# Altium schematic sheet TrailerWiringSchem.SchDoc
size A; SheetNumber: 1; SheetTotal: 1
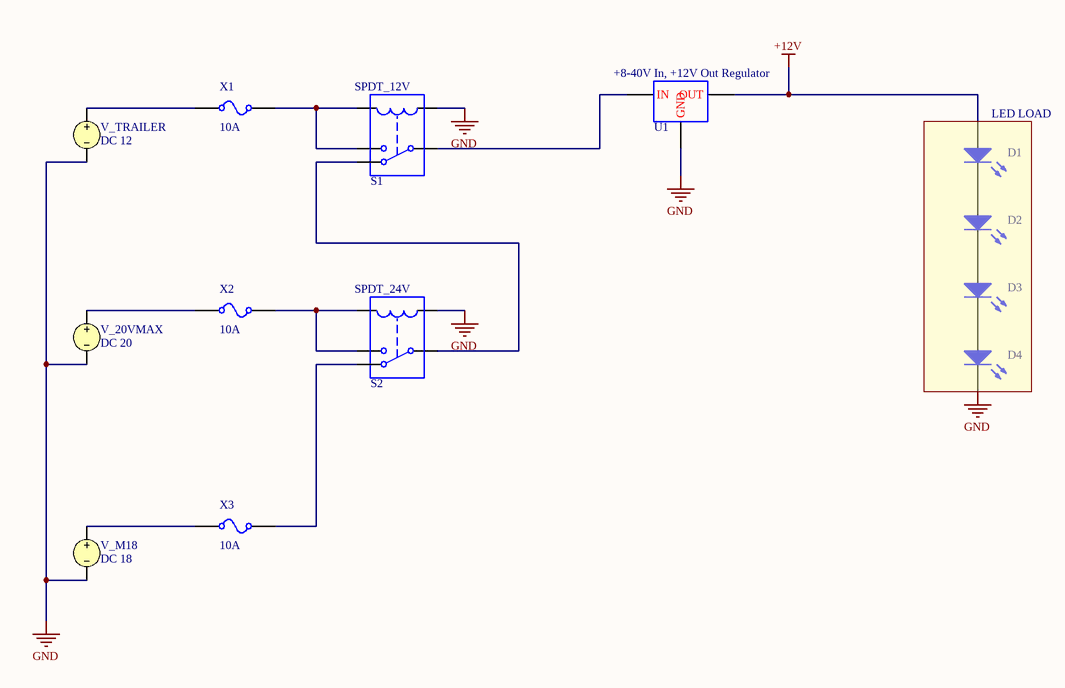
[diagram p0: TrailerWiringSchem.SchDoc]

## Parts
D1  Light-Emitting Diode  (value not drawn)
D2  Light-Emitting Diode  (value not drawn)
D3  Light-Emitting Diode  (value not drawn)
D4  Light-Emitting Diode  (value not drawn)
S1  SPDT_12V
S2  SPDT_24V
U1  +8-40V In, +12V Out Regulator
V_20VMAX  DC 20
V_M18  DC 18
V_TRAILER  DC 12
X1  CURRENT: 10A  (hidden comment: Fuse)
X2  CURRENT: 10A  (hidden comment: Fuse)
X3  CURRENT: 10A  (hidden comment: Fuse)

## Blocks framed on the sheet
LED LOAD: D1-D4

## Nets
+12V: D1.1(A) U1.3(OUT)
GND: D4.2(K) S1.4 S2.4 U1.2(GND) V_20VMAX.2 V_M18.2 V_TRAILER.2
NetD1_2: D1.2(K) D2.1(A)
NetD2_2: D2.2(K) D3.1(A)
NetD3_2: D3.2(K) D4.1(A)
NetS1_1: S1.1 U1.1(IN)
NetS1_2: S1.2 S1.5 X1.2
NetS1_3: S1.3 S2.1
NetS2_2: S2.2 S2.5 X2.2
NetS2_3: S2.3 X3.2
NetV_20VMAX_1: V_20VMAX.1 X2.1
NetV_M18_1: V_M18.1 X3.1
NetV_TRAILER_1: V_TRAILER.1 X1.1

## Library data of the parts
D1-D4 = LED: AF: 1; BV: 0; BV_MAX: 1e99; EG: 1.11; FC: 0.5; IBV: 0.001; IS: 1e-14; MJSW: 0.33; NTUN: 30; TNOM: 27; XTI: 3; SimulationGenericComponent: True; CJO: 0; CJP: 0; CTA: 0; CTP: 0; FCS: 0.5; FV_MAX: 1e99; IKF: 0; IKR: 0; ISR: 1e-14; JSW: 0; JTUN: 0; JTUNSW: 0; KEG: 1; KF: 0; LEVEL: 1; N: 1; NBV: 1; NR: 1; NS: 1; PHP: 1; RS: 0; TCV: 0; TLEV: 0; TLEVC: 0; TM1: 0; TM2: 0; TPB: 0; TPHP: 0; TRS: 0; TRS2: 0; TT: 0; TTT1: 0; TTT2: 0; VJ: 1; XTITUN: 3
S1 S2 = SPDT Relay: Single-Pole, Double-Throw Relay; L_C: 1u; R_C: 100; RON: 1; ROFF: 1e12; ION: 1m; IOFF: 0; SimulationGenericComponent: True
U1 = Linear Voltage Regulator (Fixed): Positive Fixed Voltage regulator; Av_feedback: 1665; R1_Value: 1020; SimulationGenericComponent: True
V_20VMAX = VSRC: Voltage Source; Note: PCB Footprint - Not required; AC Magnitude: 1; AC Phase: 0; Value: 20; Published: 8-Jun-2000; LatestRevisionDate: 17-Jul-2002; LatestRevisionNote: Re-released for DXP Platform.; PackageReference: Not Applicable; Publisher: Altium Limited
V_M18 = VSRC: Voltage Source; Note: PCB Footprint - Not required; AC Magnitude: 1; AC Phase: 0; Value: 18; Published: 8-Jun-2000; LatestRevisionDate: 17-Jul-2002; LatestRevisionNote: Re-released for DXP Platform.; PackageReference: Not Applicable; Publisher: Altium Limited
V_TRAILER = VSRC: Voltage Source; Note: PCB Footprint - Not required; AC Magnitude: 1; AC Phase: 0; Value: 12; Published: 8-Jun-2000; LatestRevisionDate: 17-Jul-2002; LatestRevisionNote: Re-released for DXP Platform.; PackageReference: Not Applicable; Publisher: Altium Limited
X1-X3 = Fuse: RESISTANCE: 1m; SimulationGenericComponent: True